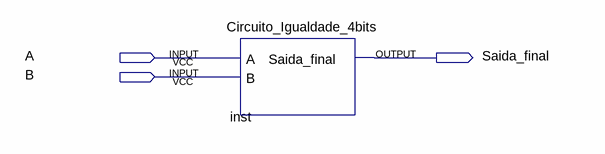
[diagram p0: schematic sheet]
// Quartus schematic modulo_unico_5bits_compactado.bdf as structural Verilog: 1 symbols, 3 pins
module modulo_unico_5bits_compactado (
  input  A,
  input  B,
  output Saida_final
);

  Circuito_Igualdade_4bits inst (.A(A), .B(B), .Saida_final(Saida_final));
endmodule
